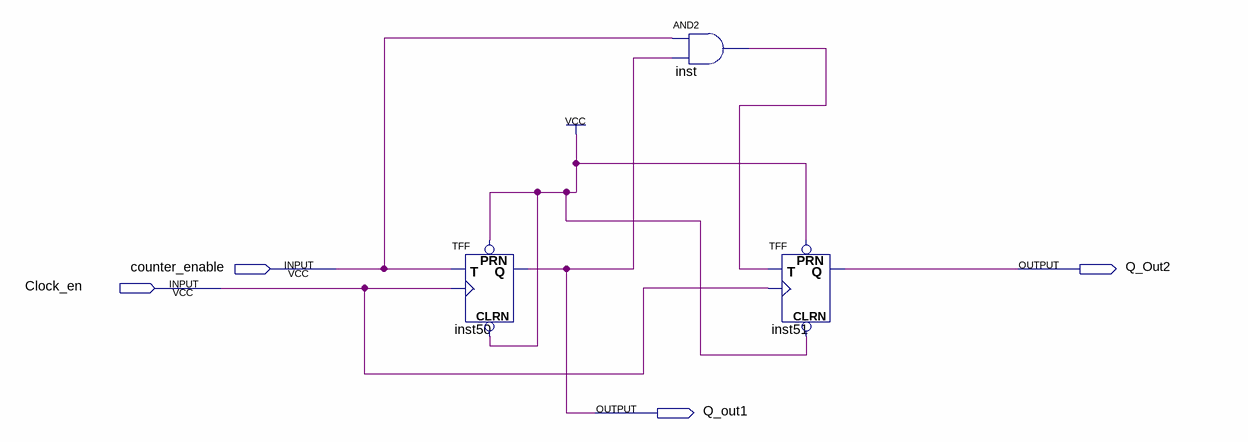
[diagram p0: schematic sheet]
// Quartus schematic twobitcounter.bdf as structural Verilog: 3 symbols, 4 pins
module twobitcounter (
  input  counter_enable,
  input  Clock_en,
  output Q_Out2,
  output Q_out1
);

  wire inst_out;

  TFF inst50 (.PRN(1'b1), .CLRN(1'b1), .T(counter_enable), .CLK(Clock_en), .Q(Q_out1));
  and inst (inst_out, counter_enable, Q_out1);
  TFF inst51 (.PRN(1'b1), .CLRN(1'b1), .T(inst_out), .CLK(Clock_en), .Q(Q_Out2));
endmodule
